# Altium schematic sheet SCA-Control.SchDoc: SCA Control
size A; DocumentNumber: 19; SheetNumber: 19; SheetTotal: 22
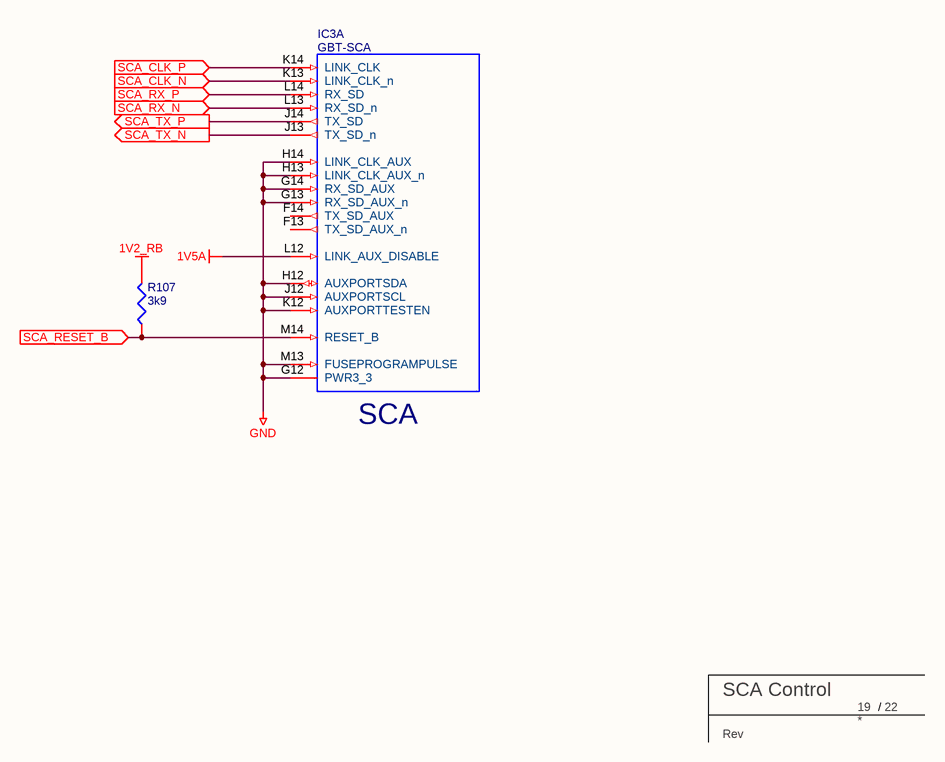
[diagram p0: SCA-Control.SchDoc]

## Parts
IC3  GBT-SCA  [BGA196C80P14X14_1200X1200X170]  (part A of 6)
R107  3k9  [R_0402_IPC]
TBLOCK?  BU Title block  (value not drawn)  (graphical)

## Ports
SCA_CLK_N (in), SCA_CLK_P (in), SCA_RESET_B (in), SCA_RX_N (in), SCA_RX_P (in), SCA_TX_N (out), SCA_TX_P (out)

## Nets
1V2_RB: R107.2
1V5A: IC3.L12(LINK_AUX_DISABLE)
GND: IC3.G12(PWR3_3) IC3.G13(RX_SD_AUX_n) IC3.G14(RX_SD_AUX) IC3.H12(AUXPORTSDA) IC3.H13(LINK_CLK_AUX_n) IC3.H14(LINK_CLK_AUX) IC3.J12(AUXPORTSCL) IC3.K12(AUXPORTTESTEN) IC3.M13(FUSEPROGRAMPULSE)
SCA_CLK_N: IC3.K13(LINK_CLK_n) ; port SCA_CLK_N
SCA_CLK_P: IC3.K14(LINK_CLK) ; port SCA_CLK_P
SCA_RESET_B: IC3.M14(RESET_B) R107.1 ; port SCA_RESET_B
SCA_RX_N: IC3.L13(RX_SD_n) ; port SCA_RX_N
SCA_RX_P: IC3.L14(RX_SD) ; port SCA_RX_P
SCA_TX_N: IC3.J13(TX_SD_n) ; port SCA_TX_N
SCA_TX_P: IC3.J14(TX_SD) ; port SCA_TX_P

Not connected (* = marked no-connect by the designer): IC3 F13(TX_SD_AUX_n) F14(TX_SD_AUX)

## Notes on the sheet
- (near IC3) SCA
- (in symbol TITLE_BLOCK_BU) /; Rev

## Library data of the parts
IC3 = CERN_GBT-SCA_REV 6.2: The Slow Control Adapter ASIC for the GBT System; Device: GBT-SCA
R107 = R-E3-3K9-0402-5%: RES SMD 3.9K OHM 5% 1/16W 0402
TBLOCK? = TITLE_BLOCK_BU